# Altium schematic sheet health-sensor-i2c.SchDoc
size A4
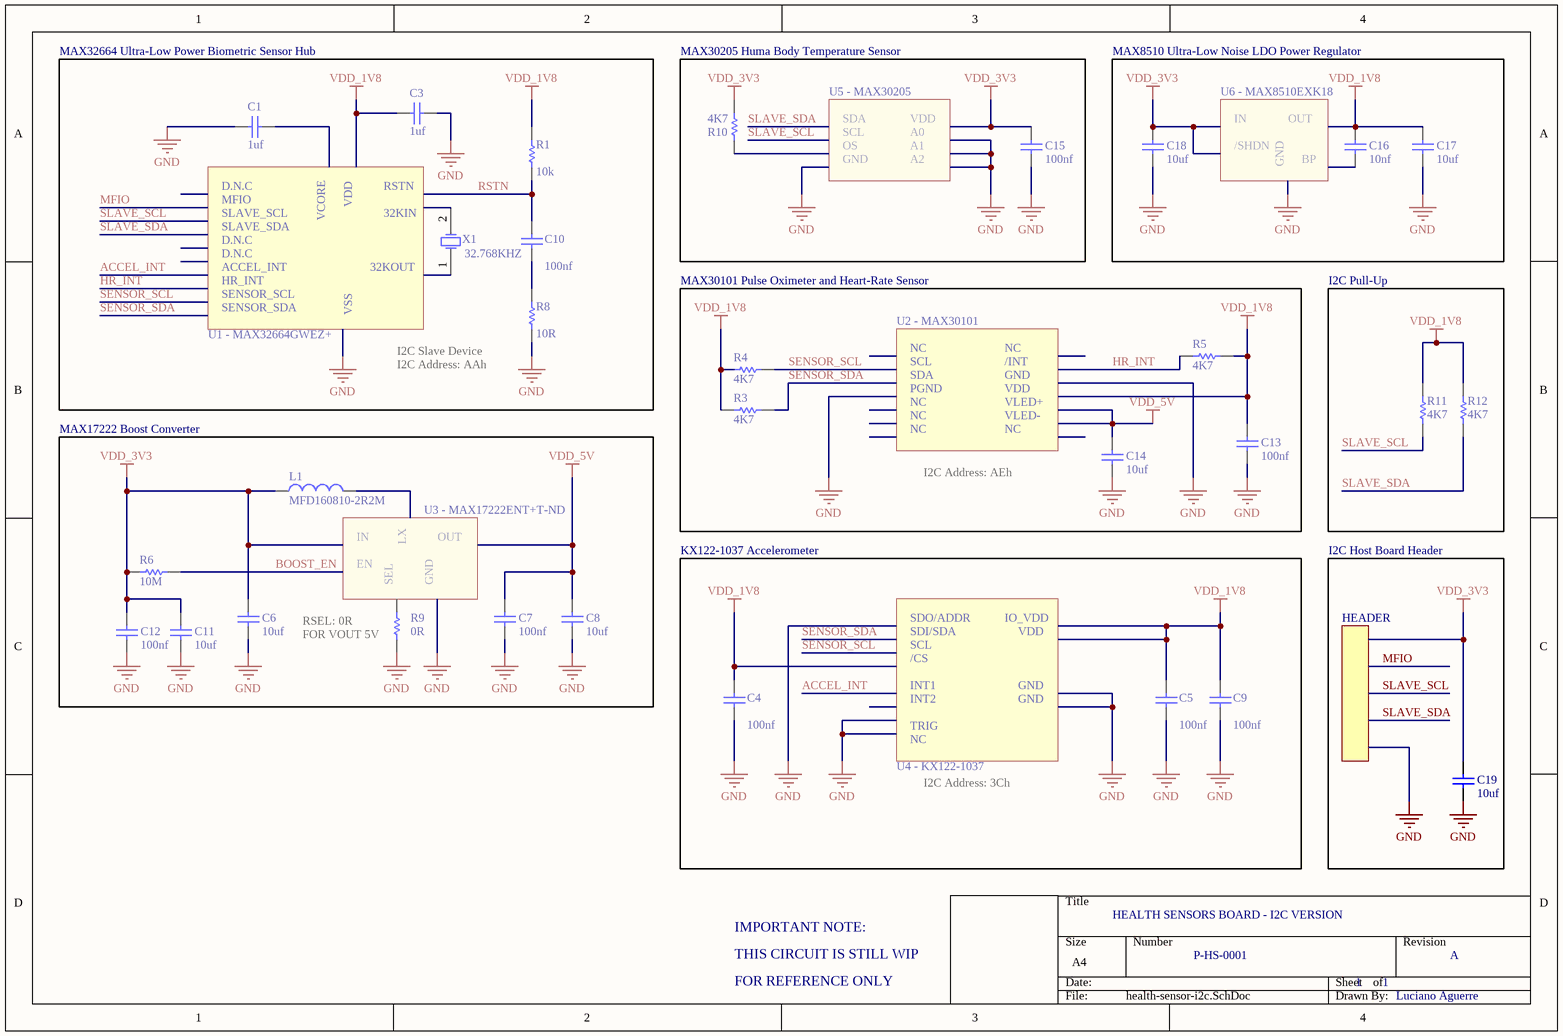
[diagram p0: health-sensor-i2c.SchDoc]

## Parts
C1  value 1uf  [RAD-0.3]  (hidden comment: Cap)
C3  value 1uf  [RAD-0.3]  (hidden comment: Cap)
C4  value 100nf  [RAD-0.3]  (hidden comment: Cap)
C5  value 100nf  [RAD-0.3]  (hidden comment: Cap)
C6  value 10uf  [RAD-0.3]  (hidden comment: Cap)
C7  value 100nf  [RAD-0.3]  (hidden comment: Cap)
C8  value 10uf  [RAD-0.3]  (hidden comment: Cap)
C9  value 100nf  [RAD-0.3]  (hidden comment: Cap)
C10  value 100nf  [RAD-0.3]  (hidden comment: Cap)
C11  value 10uf  [RAD-0.3]  (hidden comment: Cap)
C12  value 100nf  [RAD-0.3]  (hidden comment: Cap)
C13  value 100nf  [RAD-0.3]  (hidden comment: Cap)
C14  value 10uf  [RAD-0.3]  (hidden comment: Cap)
C15  value 100nf  [RAD-0.3]  (hidden comment: Cap)
C16  value 10nf  [RAD-0.3]  (hidden comment: Cap)
C17  value 10uf  [RAD-0.3]  (hidden comment: Cap)
C18  value 10uf  [RAD-0.3]  (hidden comment: Cap)
C19  value 10uf  [RAD-0.3]  (hidden comment: Cap)
L1  MFD160810-2R2M  [0402-A]
R1  value 10k  [AXIAL-0.3]  (hidden comment: Res1)
R3  value 4K7  [AXIAL-0.3]  (hidden comment: Res1)
R4  value 4K7  [AXIAL-0.3]  (hidden comment: Res1)
R5  value 4K7  [AXIAL-0.3]  (hidden comment: Res1)
R6  value 10M  [AXIAL-0.3]  (hidden comment: Res1)
R8  value 10R  [AXIAL-0.3]  (hidden comment: Res1)
R9  value 0R  [AXIAL-0.3]  (hidden comment: Res1)
R10  value 4K7  [AXIAL-0.3]  (hidden comment: Res1)
R11  value 4K7  [AXIAL-0.3]  (hidden comment: Res1)
R12  value 4K7  [AXIAL-0.3]  (hidden comment: Res1)
X1  32.768KHZ  [R38]

## Blocks framed on the sheet
I2C Pull-Up: R11 R12

## Nets
GND: C1.2 C3.1 C4.1 C5.1 C6.1 C7.1 C8.1 C9.1 C11.1 C12.1 C13.1 C14.1 C15.1 C17.1 C18.1 C19.1 R8.1 R9.1
VDD_1V8: C3.2 C4.2 C5.2 C9.2 C13.2 C16.2 C17.2 R1.2 R3.2 R4.2 R5.1 R11.1 R12.1
VDD_3V3: C6.2 C11.2 C12.2 C15.2 C18.2 C19.2 L1.1 R6.2 R10.2
VDD_5V: C7.2 C8.2 C14.2
BOOST_EN: R6.1
HR_INT: R5.2
RSTN: C10.2 R1.1
SENSOR_SCL: R4.1
SENSOR_SDA: R3.1
SLAVE_SCL: R11.2
SLAVE_SDA: R12.2
NetC10_1: C10.1 R8.2

Not connected (* = marked no-connect by the designer): C1 1; C16 1; L1 2; R9 2; R10 1; X1 1(OSC1) 2(OSC2)

## Notes on the sheet
- MAX32664 Ultra-Low Power Biometric Sensor Hub
- MAX30205 Huma Body Temperature Sensor
- U5 - MAX30205
- MAX8510 Ultra-Low Noise LDO Power Regulator
- U6 - MAX8510EXK18
- SDA
- SCL
- OS
- GND
- VDD
- A0
- A1
- A2
- IN
- /SHDN
- (near C16) OUT
- (near C16) BP
- D.N.C
- MFIO
- SLAVE_SCL
- SLAVE_SDA
- VCORE
- RSTN
- (near X1) 32KIN
- ACCEL_INT
- HR_INT
- SENSOR_SCL
- SENSOR_SDA
- VSS
- (near X1) 32KOUT
- MAX30101 Pulse Oximeter and Heart-Rate Sensor
- U1 - MAX32664GWEZ+
- U2 - MAX30101
- NC
- /INT
- MAX17222 Boost Converter
- (near R8) I2C Slave Device
  I2C Address: AAh
- PGND
- VLED+
- VLED-
- U3 - MAX17222ENT+T-ND
- I2C Address: AEh
- (near L1) IN
- EN
- (near R9) SEL
- LX
- (near R9) GND
- OUT
- KX122-1037 Accelerometer
- I2C Host Board Header
- (near R9) RSEL: 0R
  FOR VOUT 5V
- SDO/ADDR
- SDI/SDA
- IO_VDD
- HEADER
- /CS
- INT1
- INT2
- U4 - KX122-1037
- TRIG
- I2C Address: 3Ch
- HEALTH SENSORS BOARD - I2C VERSION
- IMPORTANT NOTE:
- THIS CIRCUIT IS STILL WIP
- FOR REFERENCE ONLY
- P-HS-0001
- 1
- A
- Luciano Aguerre

## Library data of the parts
C1 C3-C19 = Cap: Capacitor; Published: 8-Jun-2000; LatestRevisionDate: 17-Jul-2002; LatestRevisionNote: Re-released for DXP Platform.; PackageReference: RAD-0.3; Publisher: Altium Limited; PackageDescription: Radial Cap, Thru-Hole; 2 Leads; 0.3 in Pin Spacing
L1 = Inductor: Code_IEC: 1005; Value: 10mH; Published: 8-Jun-2000; LatestRevisionDate: 29-May-2009; LatestRevisionNote: IPC-7351 Footprint Added.; PackageReference: 0402-A; Publisher: Altium Limited; PackageDescription: Chip Inductor; Code_JEITA: 0402
R1 R3-R6 R8-R12 = Res1: Resistor; Published: 8-Jun-2000; LatestRevisionDate: 17-Jul-2002; LatestRevisionNote: Re-released for DXP Platform.; PackageReference: AXIAL-0.3; Publisher: Altium Limited; PackageDescription: Axial Device, Thru-Hole; 2 Leads; 0.3 in Pin Spacing
X1 = XTAL: Crystal Oscillator; Published: 8-Jun-2000; LatestRevisionDate: 17-Jul-2002; LatestRevisionNote: Re-released for DXP Platform.; PackageReference: R38; Publisher: Altium Limited; PackageDescription: Crystal, Thru-Hole; 2 Leads; Body 3.1 x 8.2 mm (Dia.xH)